# EAGLE design transmitter (EAGLE 8.3.2)
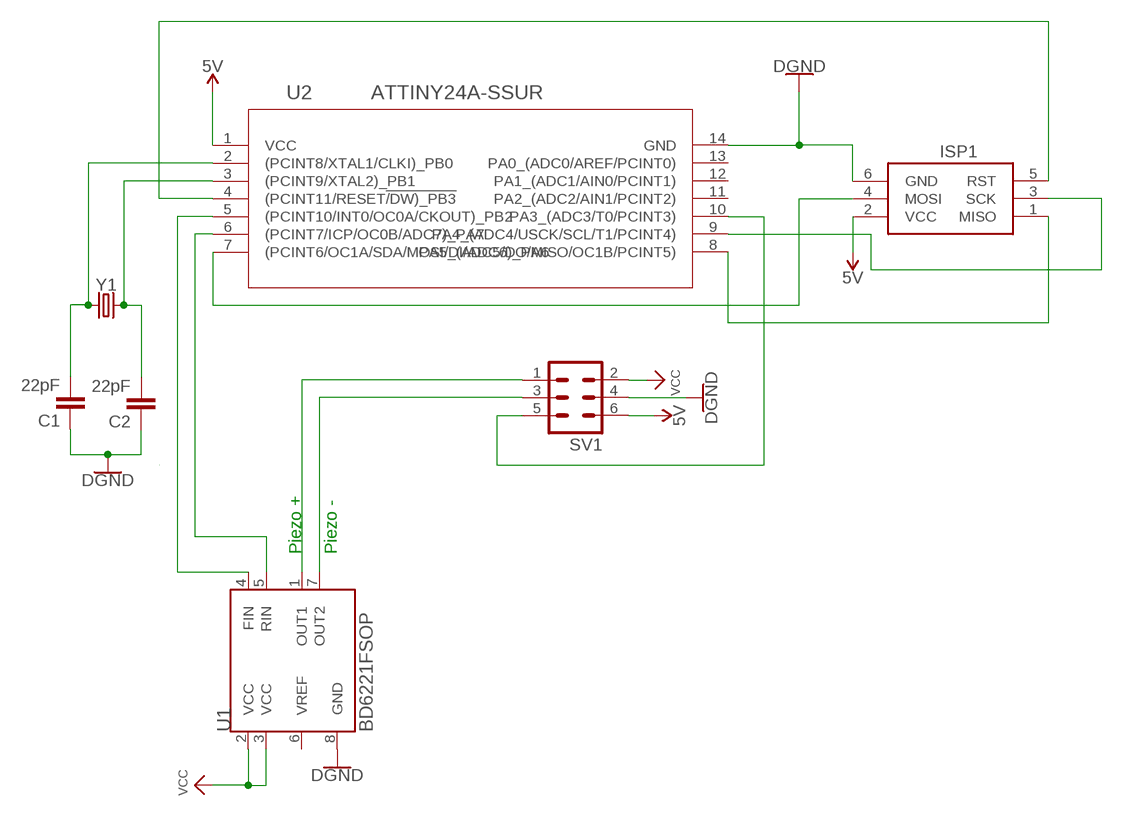
[diagram p0: schematic, sheet 1]

## Parts
C1  22pF  0.75PF-50V(-/+.25PF)(0603)  [0603]
C2  22pF  0.75PF-50V(-/+.25PF)(0603)  [0603]
ISP1  AVRISP-6  [AVRISP]
SV1  MA03-2  [MA03-2]
U1  BD6221FSOP  [SOP8]
U2  ATTINY24A-SSUR  [14S1]
Y1  CRYSTALPTH-HC49US  [HC49US]

## Nets
5V: ISP1.2(VCC) SV1.6 U2.1(VCC)
12V: SV1.2 U1.2(VCC) U1.3(VCC) ; supply symbol labelled VCC
FIN: U1.4(FIN) U2.5((PCINT10/INT0/OC0A/CKOUT)_PB2)
GND: C1.1 C2.1 ISP1.6(GND) SV1.4 U1.8(GND) U2.14(GND) ; supply symbol labelled DGND
IO: SV1.5 U2.10(PA3_(ADC3/T0/PCINT3))
MISO: ISP1.1(MISO) U2.8(PA5_(ADC5/DO/MISO/OC1B/PCINT5))
MOSI: ISP1.4(MOSI) U2.7((PCINT6/OC1A/SDA/MOSI/DI/ADC6)_PA6)
PIEZO+: SV1.1 U1.1(OUT1)
PIEZO-: SV1.3 U1.7(OUT2)
RESET: ISP1.5(RST) U2.4((PCINT11/RESET!/DW)_PB3)
RIN: U1.5(RIN) U2.6((PCINT7/ICP/OC0B/ADC7)_PA7)
SCK: ISP1.3(SCK) U2.9(PA4_(ADC4/USCK/SCL/T1/PCINT4))
XTAL1: C1.2 U2.2((PCINT8/XTAL1/CLKI)_PB0) Y1.1
XTAL2: C2.2 U2.3((PCINT9/XTAL2)_PB1) Y1.2
Unconnected: U1.6(VREF) U2.11(PA2_(ADC2/AIN1/PCINT2)) U2.12(PA1_(ADC1/AIN0/PCINT1)) U2.13(PA0_(ADC0/AREF/PCINT0))

## Notes on the sheet
- Piezo + | Piezo -

## Library data of the parts
C1 C2 = SparkFun-Retired:0.75PF-50V(-/+.25PF)(0603): CAP-07878; PROD_ID: CAP-07878; VALUE: 0.75pF
ISP1 = adafruit:AVRISP: AVR ISP HEADER Standard 6 pin header for AVR programming
SV1 = con-lstb:MA03-2: PIN HEADER; OC_FARNELL: unknown; OC_NEWARK: unknown
U1 = CamSensComponents:BD6221F: H-bridge driver (full bridge driver) for brush motor applications
U2 = ATTINY24A-SSUR:ATTINY24A-SSUR; MANUFACTURER_PART_NUMBER: ATTINY24ASSUR; VENDOR: Atmel
Y1 = SparkFun-Clocks:CRYSTAL: Crystals (Generic) These are passive quartz crystals, which can be used as a clock source for a microcontroller. Crystal's are two-terminal devices. They require external "load" capacitors to generate an oscillating signal.

## Board
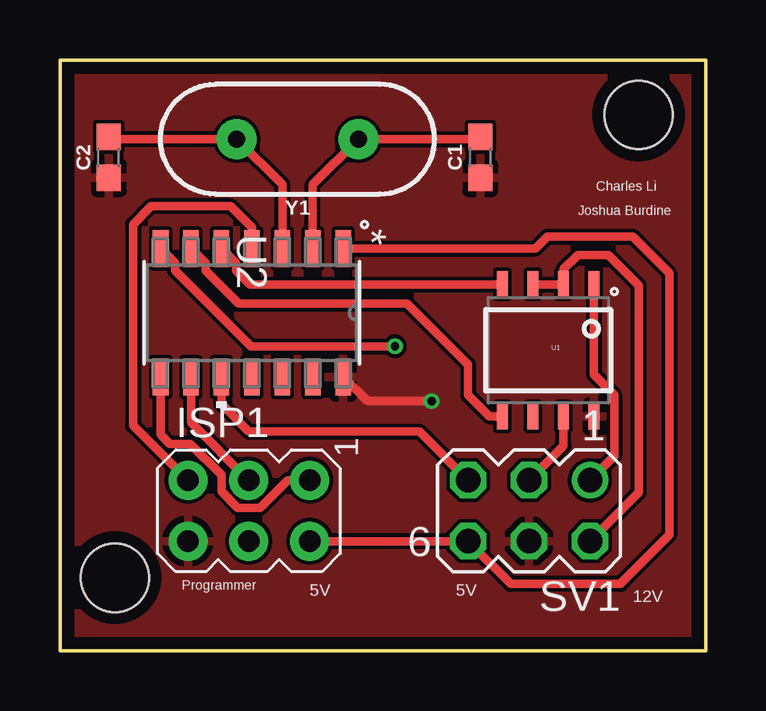
[diagram p1: board, top side]
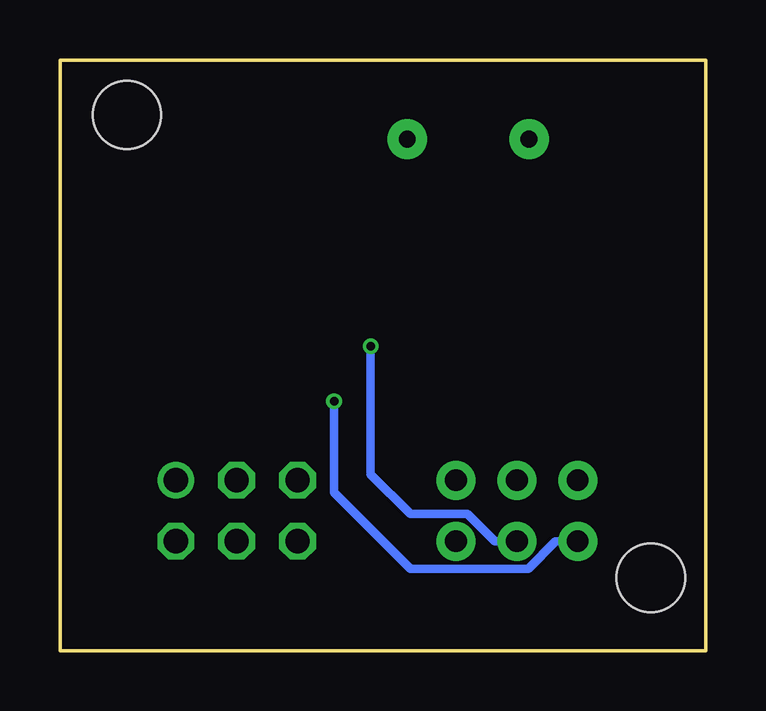
[diagram p2: board, bottom side, seen from below]

Size 26.92 x 24.64 mm. Coordinates in mm from the lower left corner, seen from the top.
Outline: 0,24.64 0,0 26.92,0 26.92,24.64 0,24.64
Copper layers (1*16): Top 0.035mm / dielectric 1.6mm / Bottom 0.035mm
Design rules "Elecrow_2-layer_PCB_eagle_rule": minimum track width 6mil, minimum drill 12mil, track to track 6mil, track to pad 6mil, pad to pad 6mil, via to via 8mil, smd to smd 0mil, copper to edge 20mil, drill to drill 10mil, minimum pad ring 6mil, minimum via ring 6mil, stop-mask expansion 0mil, vias tented up to drill 100mil, thermal gap 10mil
Holes 2.85 mm at 2.29,3.05 24.13,22.35

### Footprints (pad centres in the part's own frame; a part is rotated, then mirrored left to right if it is on the bottom)
0603 = smd 1.1 x 1: 1 -0.85,0; 2 0.85,0
AVRISP = drill 0.9 pad 1.626: 1 -1.27,2.54; 2 1.27,2.54; 3 -1.27,0; 4 1.27,0; 5 -1.27,-2.54; 6 1.27,-2.54
MA03-2 = drill 1.016: 1 -2.54,-1.27 | drill 1.016 octagon: 2 -2.54,1.27; 3 0,-1.27; 4 0,1.27; 5 2.54,-1.27; 6 2.54,1.27
SOP8 = smd 0.462 x 1.1: 1 0.595,-0.55; 2 1.865,-0.55; 3 3.135,-0.55; 4 4.405,-0.55; 5 4.405,4.95; 6 3.135,4.95; 7 1.865,4.95; 8 0.595,4.95
14S1 = smd 1.549 x 0.66: 1 -2.68,3.81; 2 -2.68,2.54; 3 -2.68,1.27; 4 -2.68,0; 5 -2.68,-1.27; 6 -2.68,-2.54; 7 -2.68,-3.81; 8 2.68,-3.81; 9 2.68,-2.54; 10 2.68,-1.27; 11 2.68,0; 12 2.68,1.27; 13 2.68,2.54; 14 2.68,3.81
HC49US = drill 0.7 pad 1.651: 1 -2.54,0; 2 2.54,0

### Placement (x,y rotation side)
C1  17.53,20.57 90 top
C2  2.03,20.57 90 top
ISP1  7.87,5.84 270 top
SV1  19.56,5.84 180 top
U1  22.86,14.73 180 top
U2  8,14.1 270 top
Y1  9.91,21.34 180 top

### Tracks (layer width: path | path; a pad name or v marks a point on that pad's centre or on a via)
5V
  Top 0.356: ISP1.2 SV1.6 18.8,2.79 23.37,2.79 25.4,4.83 25.4,15.75 23.88,17.27 20.32,17.27 19.94,16.89 | 19.94,16.89 19.83,16.78 | U2.1 19.83,16.78 | 19.83,16.78 19.94,16.89
12V
  Top 0.356: U1.3 U1.2 20.99,15.91 21.59,16.51 22.86,16.51 24.13,15.24 24.13,6.6 SV1.2
FIN
  Top 0.356: U2.5 7.34,16.17 7.34,15.86 7.92,15.28 U1.4
GND  (via drill 0.35)
  Top 0.356: U2.14 12.81,10.41 v15.49,10.41
  Bottom 0.356: v15.49,10.41 15.49,6.6 12.32,3.43 7.4,3.43 6.26,4.57 ISP1.6
  pour Top: 0,24.64 26.92,24.64 26.92,0 0,0
IO
  Top 0.356: U2.10 6.73,10.29 7.87,9.14 14.99,9.14 SV1.5
MISO
  Top 0.356: ISP1.1 9.49,7.11 8.35,5.97 7.4,5.97 6.73,6.64 6.73,7.33 5.43,8.64 4.57,8.64 4.19,9.02 U2.8
MOSI  (via drill 0.35)
  Top 0.356: U2.7 4.8,16.17 4.8,15.86 7.97,12.7 v13.97,12.7
  Bottom 0.356: v13.97,12.7 13.97,7.37 12.32,5.71 9.94,5.71 8.8,4.57 ISP1.4
PIEZO+
  Top 0.356: U1.1 22.27,11.52 23.11,10.67 23.11,8.13 SV1.1
PIEZO-
  Top 0.356: SV1.3 20.99,8.55 U1.7
RESET
  Top 0.356: U2.4 8,17.65 7.11,18.54 3.81,18.54 3.05,17.78 3.05,9.4 ISP1.5
RIN
  Top 0.356: U2.6 6.07,16.17 6.07,15.86 7.46,14.48 14.48,14.48 17.02,11.94 17.02,10.67 17.9,9.78 U1.5
SCK
  Top 0.356: ISP1.3 5.46,9.53 U2.9
XTAL1
  Top 0.356: 10.54,17.14 U2.2 10.54,19.43 Y1.1 17.44,21.34 C1.2
XTAL2
  Top 0.356: U2.3 9.27,19.43 Y1.2 2.12,21.34 C2.2

### Text on the board
tPlace: Charles Li | Joshua Burdine | C:/Users/JoshuaB/Documents/pinkfloyd.bmp | Programmer | 5V | 5V | 12V